# Altium schematic sheet Sheet.SchDoc: IOElectro Simple Oscilloscope
size A4; Author: -; CompanyName: IOElectro; DrawnBy: Esmaeill M; Engineer: -; Organization: IOElectro; Address1: Bushehr,Iran; Address2: www.ioelectro.ir; DocumentNumber: 1; Revision: v0.1; SheetNumber: 1; SheetTotal: 6; ProjectNumber: 1013; Note: -
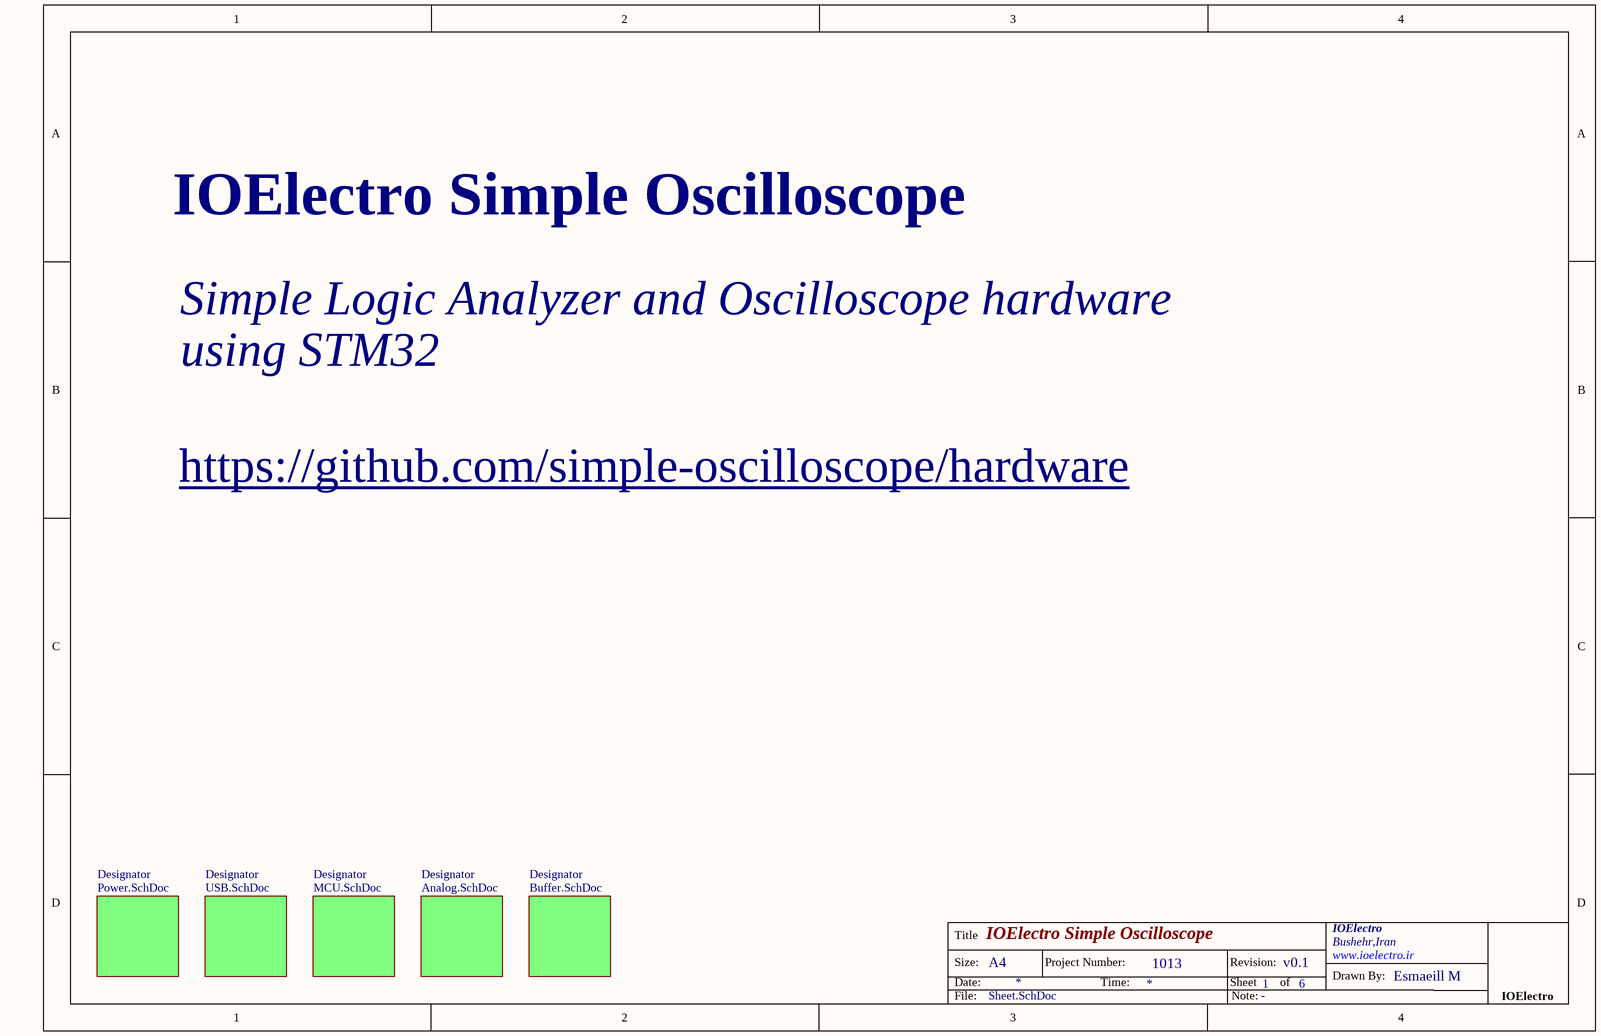
[diagram p0: Sheet.SchDoc]

## Sub-sheets
Designator = Power.SchDoc: no entries
Designator = USB.SchDoc: no entries
Designator = MCU.SchDoc: no entries
Designator = Analog.SchDoc: no entries
Designator = Buffer.SchDoc: no entries

## Notes on the sheet
- IOElectro Simple Oscilloscope
- Simple Logic Analyzer and Oscilloscope hardware
- using STM32
- https://github.com/simple-oscilloscope/hardware
- Title
- Size:
- Date:
- A4
- Project Number:
- Time:
- Revision:
- Sheet
- of
- Drawn By:
- IOElectro
- File:
- Note: